# EasyEDA Pro project LCEDA.epro

# Schematic Schematic1
Create Date: 2024-02-26; Page Name: P1; Project Name: 志远; Schematic Name: Schematic1; Update Date: 2024-02-26; Company: 嘉立创EDA; Page Size: A4; Version: V1.0
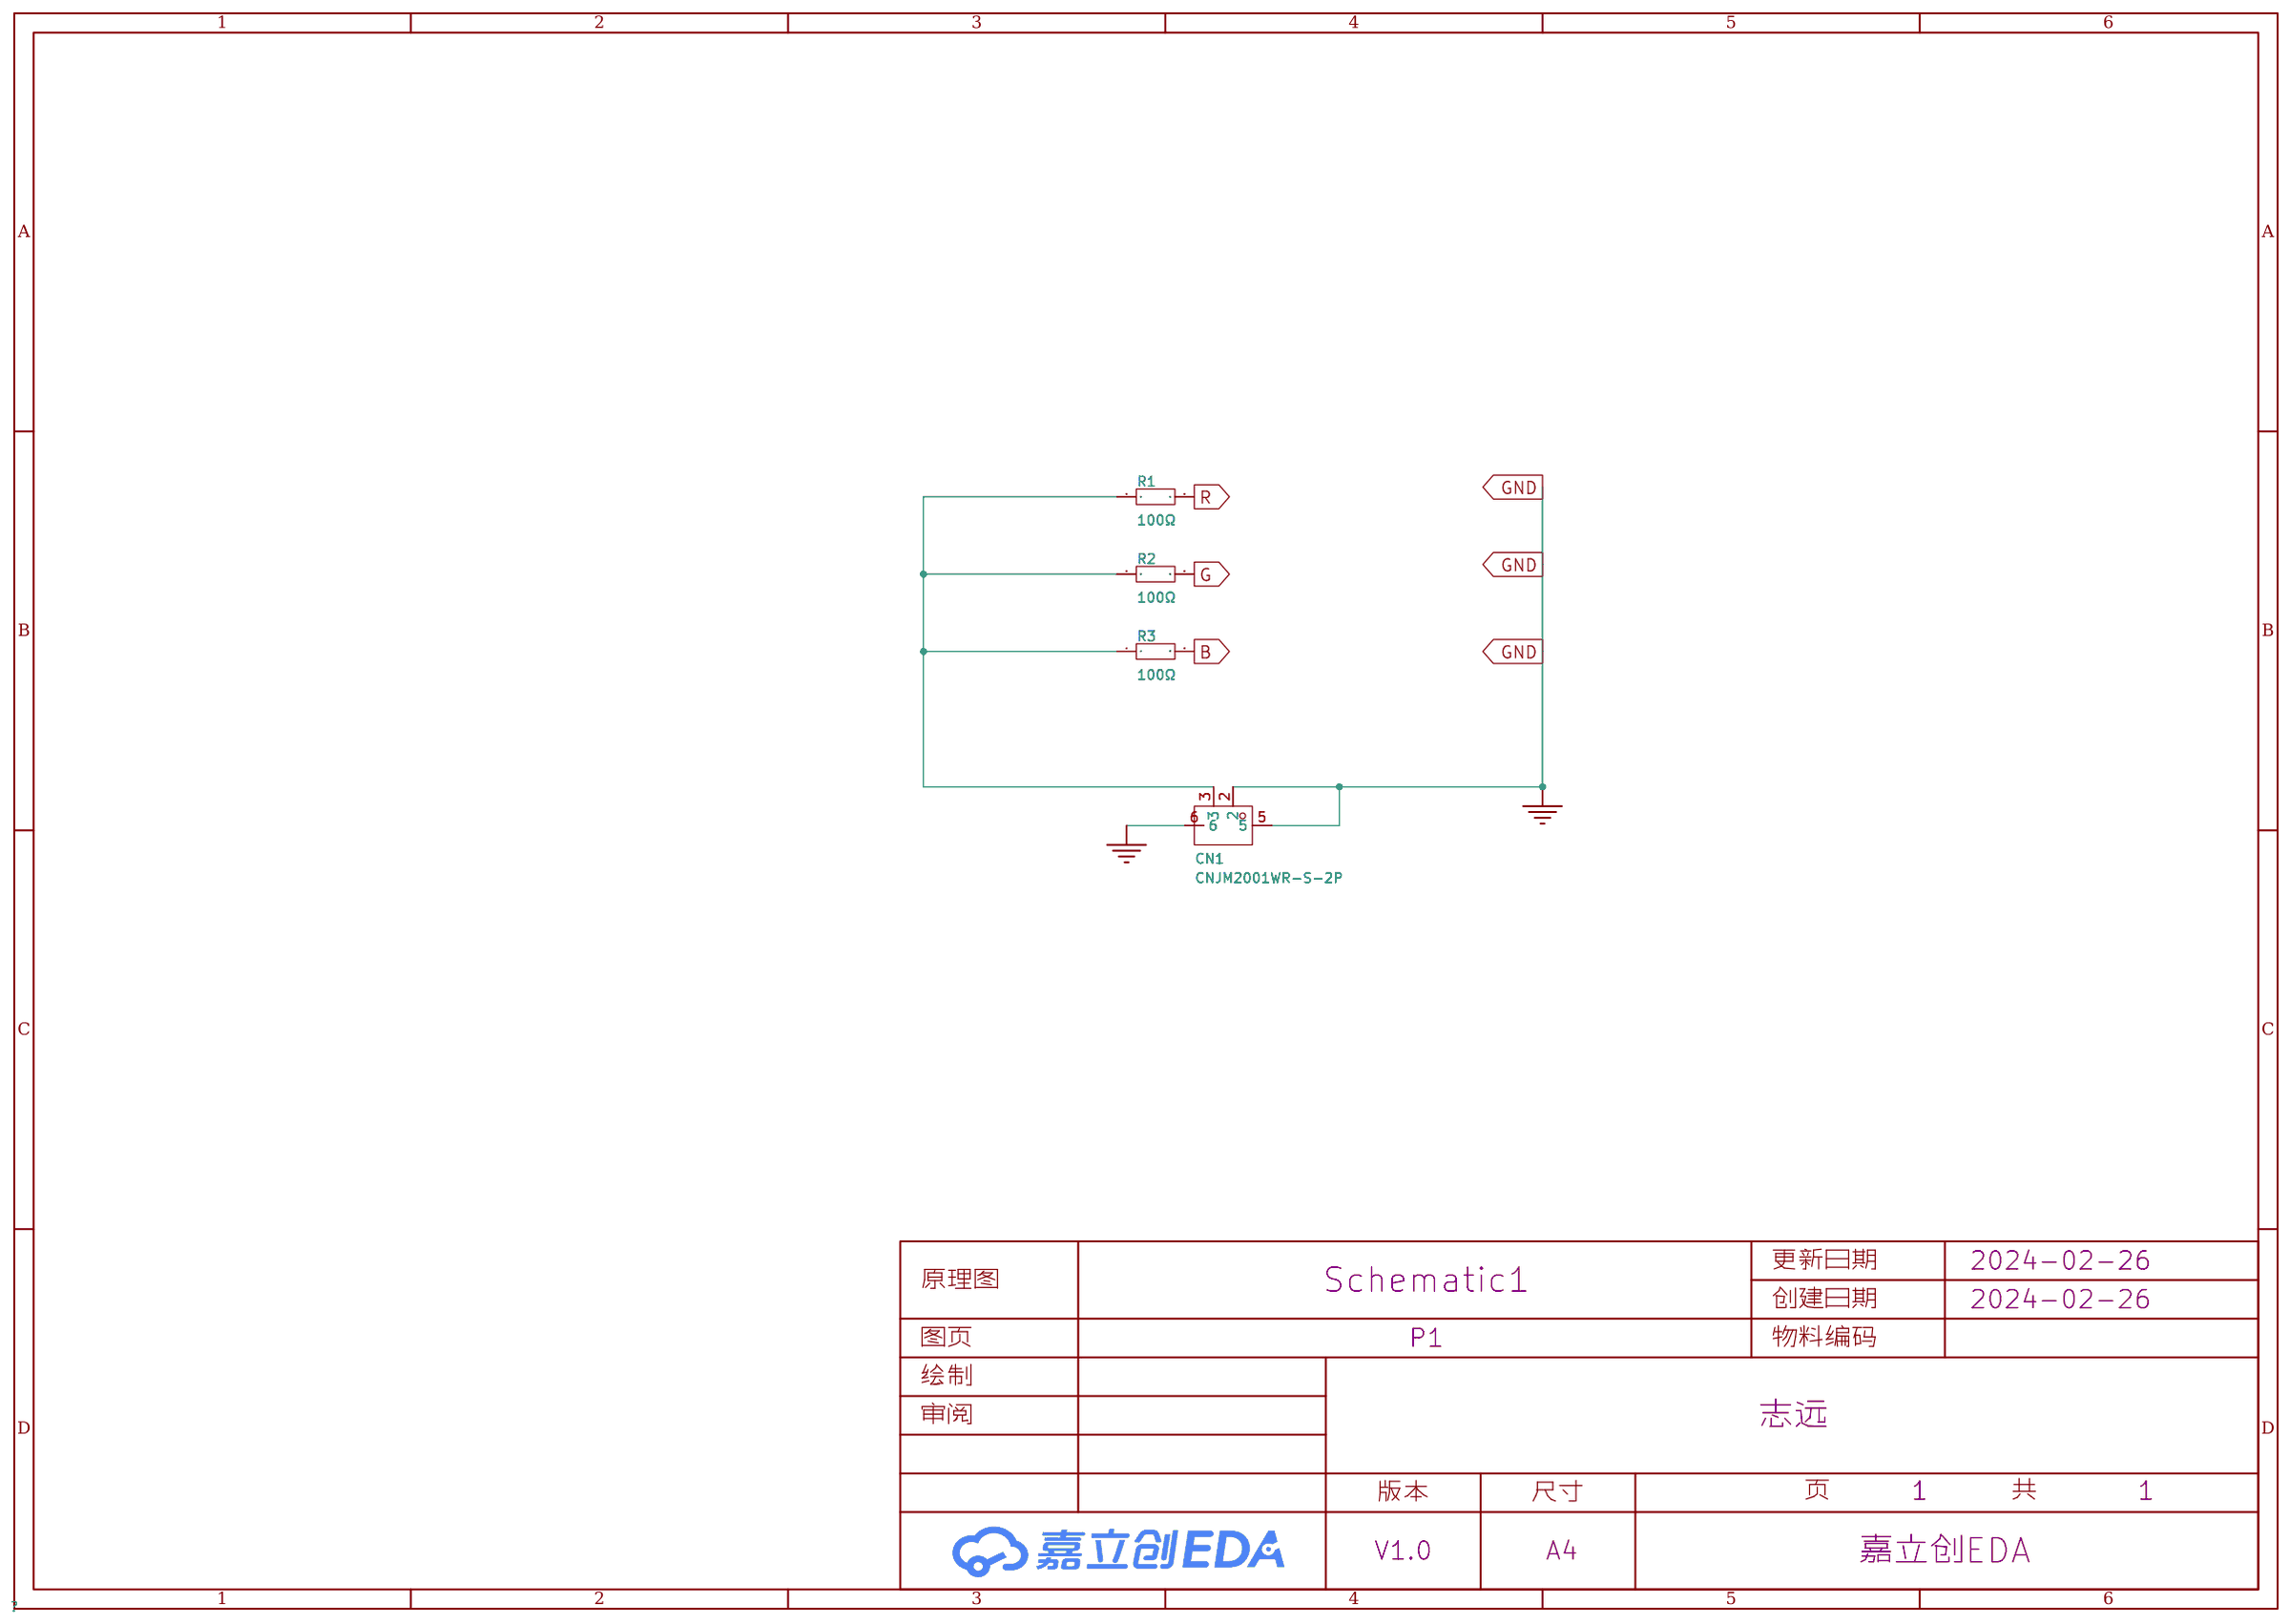
[diagram p0: schematic sheet]

## Parts
CN1  CNJM2001WR-S-2P  [FPC-SMD_CNJM2001WR-S-2P]
R1  100Ω  [R1210]
R2  100Ω  [R1210]
R3  100Ω  [R1210]

## Library data of the parts
CN1 = CNJM2001WR-S-2P: LCSC Part Name: PH2.0 卧贴 1X2P; Supplier Part: C881493; Manufacturer: CNJM(九木精密); Supplier Footprint: SMD,P=2mm; JLCPCB Part Class: 扩展库; Datasheet: https://atta.szlcsc.com/upload/public/pdf/source/20201013/C881493_8925791FA6A274699ED0B2286005888F.pdf; Supplier: LCSC
R1-R3 = 1210W2F1000T5E: 电阻类型:厚膜电阻;阻值:100Ω;精度:±1%;功率:500mW;最大工作电压:200V;温度系数:±100ppm/℃;; LCSC Part Name: 100Ω ±1% 500mW 厚膜电阻; Supplier Part: C620661; Manufacturer: UNI-ROYAL(厚声); Supplier Footprint: 1210; JLCPCB Part Class: Extended Part; Datasheet: https://atta.szlcsc.com/upload/public/pdf/source/20200306/C422600_1E6D84923E4A46A82E41ADD87F860B5C.pdf; Supplier: LCSC; Type: 厚膜电阻; Tolerance: ±1%; Power(Watts): 500mW; Overload Voltage (Max): 200V; Temperature Coefficient: ±100ppm/℃; Operating Temperature Range: -55℃~+155℃

## Nets
GND: CN1.2 CN1.5 CN1.6
B: R3.2
G: R2.2
R: R1.2
$1N588: CN1.3 R1.1 R2.1 R3.1

# Board PCB1
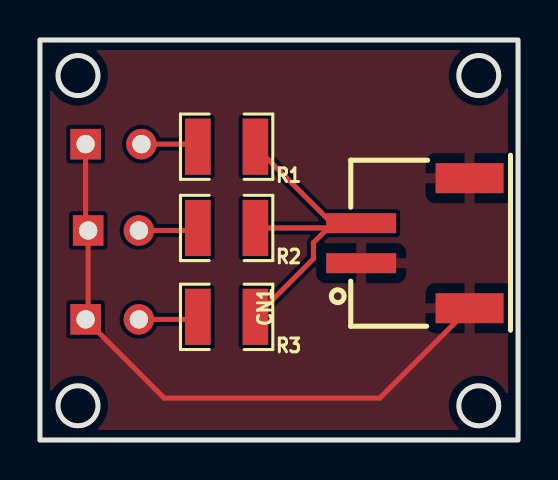
[diagram p1: board, top side]
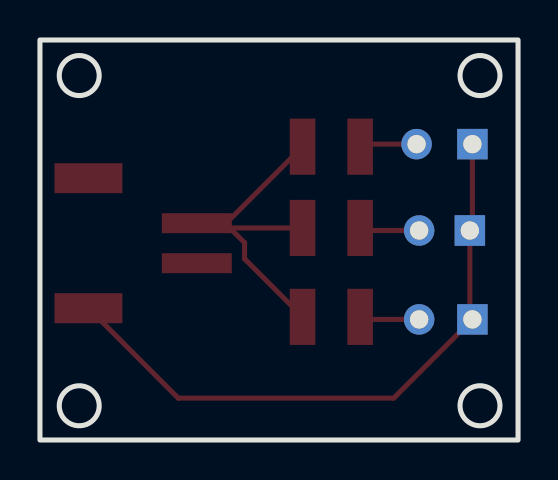
[diagram p2: board, bottom side, seen from below]

Outline 23.94 x 20 mm; copper layers: Top Layer, Bottom Layer. Coordinates in mm from the lower left corner of the outline.
Outline path: rectangle 0,20 23.94,0 ; circle c1.91,18.22 r1 ; circle c1.91,1.71 r1 ; circle c21.97,18.22 r1 ; circle c21.97,1.71 r1
Stack: Top Layer 0.035mm / Dielectric1 1.51mm FR4 er 4.5 / Bottom Layer 0.035mm

## Design rules (mm)
template: JLCPCB Capability(Two Layers Board)
spacing copperThickness1oz (default): track to track 0.102, other pairs 0.152 to 0.3
spacing copperThickness2oz: track to track 0.203, other pairs 0.152 to 0.3
track width copperThickness1oz (default): min 0.127, default 0.254, max 2.54
track width copperThickness2oz: min 0.203, default 0.254, max 2.54
differential pair differentialPair (default): width min 0.127, default 0.254, max 2.54; gap min 0.152, default 0.152
via viaSize (default): diameter min 0.5, default 0.61, max 10; hole min 0.3, default 0.305, max 6.3

## Placement (name value [footprint] x y rotation side)
CN1  CNJM2001WR-S-2P  [FPC-SMD_CNJM2001WR-S-2P]  18.8 9.84 90 top
NOREF  -  [Pad_e11]  2.29 6.03 0 top
NOREF#2  -  [Pad_e8]  4.95 6.03 0 top
NOREF#3  -  [Pad_e7]  4.95 10.47 0 top
NOREF#4  -  [Pad_e9]  2.29 14.79 0 top
NOREF#5  -  [Pad_e5]  5.08 14.79 0 top
NOREF#6  -  [Pad_e10]  2.41 10.47 0 top
R1  100Ω  [R1210]  9.35 14.67 180 top
R2  100Ω  [R1210]  9.35 10.6 180 top
R3  100Ω  [R1210]  9.35 6.16 180 top

## Footprints (pads in the part's own frame, mm; a bottom-side part is the same pattern mirrored in y, then rotated)
FPC-SMD_CNJM2001WR-S-2P
  rect 1x3.5 smd: 2(-1,2.712) 3(1,2.712)
  rect 1.5x3.4 smd: 5(3.25,-2.712) 6(-3.25,-2.712)
Pad_e5
  round 1.524 hole 0.914: 4(0,0)
Pad_e7
  round 1.524 hole 0.914: 4(0,0)
Pad_e8
  round 1.524 hole 0.914: 4(0,0)
Pad_e9
  rect 1.524x1.524 hole 0.914: GND(0,0)
Pad_e10
  rect 1.524x1.524 hole 0.914: GND(0,0)
Pad_e11
  rect 1.524x1.524 hole 0.914: GND(0,0)
R1210
  rect 1.282x2.808 smd: 1(-1.441,0) 2(1.441,0)

## Nets
As in the schematic.

Pads without a net: NOREF GND; NOREF#2 4; NOREF#3 4; NOREF#4 GND; NOREF#5 4; NOREF#6 GND

## Routing (per net, layer and track width the routed paths; a pad name or vN(x,y) marks a point on that pad's centre or on a via; arc(x,y) is an arc through that point)
GND: length 31.6
  Top Layer w0.254: 2.29,14.79 2.29,10.6 2.41,10.47 2.41,6.16 2.29,6.03 6.22,2.09 17.01,2.09 CN1.6
B: length 3
  Top Layer w0.254: 4.95,6.03 7.78,6.03 R3.2
G: length 3
  Top Layer w0.254: 4.95,10.47 7.78,10.47 R2.2
R: length 2.9
  Top Layer w0.254: 5.08,14.79 7.78,14.79 R1.2
$1N588: length 18.3
  Top Layer w0.254: 10.79,14.67 14.48,10.98 14.48,10.86 ; 10.79,10.6 15.85,10.6 CN1.3 ; 10.79,6.16 13.69,9.06 13.69,9.86 14.55,10.72 15.96,10.72

## Copper pours and planes (outline as drawn; the poured copper is in the pictures)
GND on Top Layer: -2.54,24.83 26.42,24.83 26.42,-5.15 -2.54,-5.15
